# Altium schematic sheet Limit_Switches.SchDoc: RP2040 CNC
size B; Author: AM; CompanyName: Expatria Technologies; DrawnBy: A.Marles; Engineer: AM; Organization: Expatria Technolgoies; DocumentNumber: 7; SheetNumber: 7; SheetTotal: 14
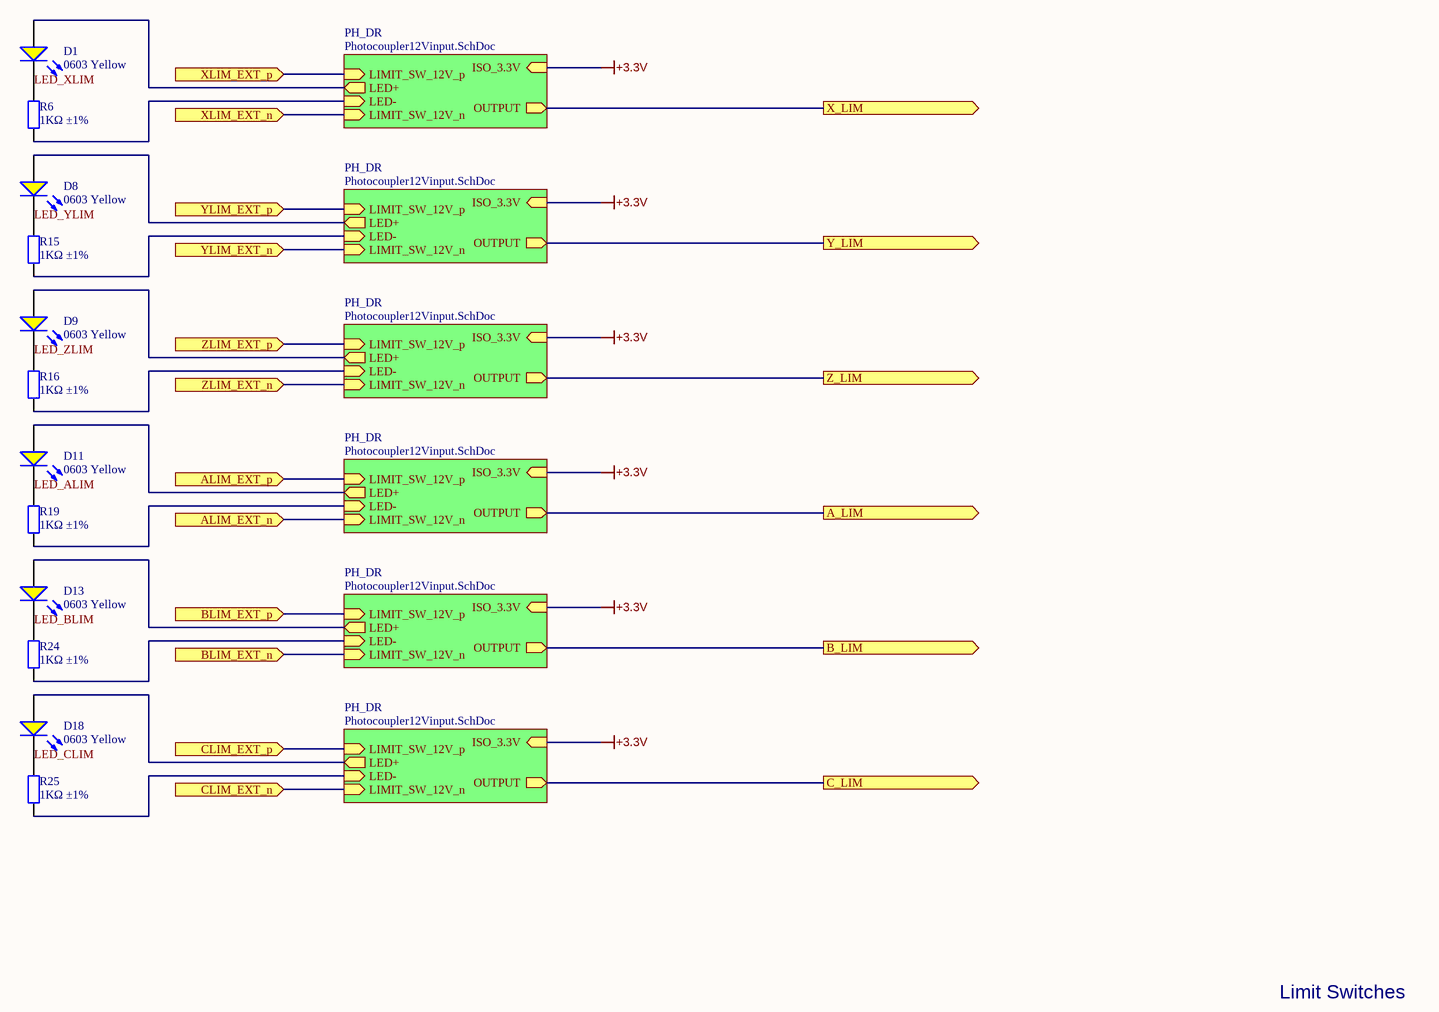
[diagram p0: Limit_Switches.SchDoc]

## Parts
D1  0603 Yellow  [0603_LED_S1]
D8  0603 Yellow  [0603_LED_S1]
D9  0603 Yellow  [0603_LED_S1]
D11  0603 Yellow  [0603_LED_S1]
D13  0603 Yellow  [0603_LED_S1]
D18  0603 Yellow  [0603_LED_S1]
R6  1KΩ ±1%  [0603_R]
R15  1KΩ ±1%  [0603_R]
R16  1KΩ ±1%  [0603_R]
R19  1KΩ ±1%  [0603_R]
R24  1KΩ ±1%  [0603_R]
R25  1KΩ ±1%  [0603_R]

## Sub-sheets
PH_DR = Photocoupler12Vinput.SchDoc: OUTPUT (out), LED+ (out), LED- (in), ISO_3.3V (in), LIMIT_SW_12V_n (in), LIMIT_SW_12V_p (in)
PH_DR = Photocoupler12Vinput.SchDoc: OUTPUT (out), LED+ (out), LED- (in), ISO_3.3V (in), LIMIT_SW_12V_n (in), LIMIT_SW_12V_p (in)
PH_DR = Photocoupler12Vinput.SchDoc: OUTPUT (out), LED+ (out), LED- (in), ISO_3.3V (in), LIMIT_SW_12V_n (in), LIMIT_SW_12V_p (in)
PH_DR = Photocoupler12Vinput.SchDoc: OUTPUT (out), LED+ (out), LED- (in), ISO_3.3V (in), LIMIT_SW_12V_n (in), LIMIT_SW_12V_p (in)
PH_DR = Photocoupler12Vinput.SchDoc: OUTPUT (out), LED+ (out), LED- (in), ISO_3.3V (in), LIMIT_SW_12V_n (in), LIMIT_SW_12V_p (in)
PH_DR = Photocoupler12Vinput.SchDoc: OUTPUT (out), LED+ (out), LED- (in), ISO_3.3V (in), LIMIT_SW_12V_n (in), LIMIT_SW_12V_p (in)

## Ports
A_LIM (out), ALIM_EXT_n (in), ALIM_EXT_p (in), B_LIM (out), BLIM_EXT_n (in), BLIM_EXT_p (in), C_LIM (out), CLIM_EXT_n (in), CLIM_EXT_p (in), X_LIM (out), XLIM_EXT_n (in), XLIM_EXT_p (in), Y_LIM (out), YLIM_EXT_n (in), YLIM_EXT_p (in), Z_LIM (out), ZLIM_EXT_n (in), ZLIM_EXT_p (in)

## Nets
+3.3V: sheet PH_DR/ISO_3.3V, sheet PH_DR/ISO_3.3V, sheet PH_DR/ISO_3.3V, sheet PH_DR/ISO_3.3V, sheet PH_DR/ISO_3.3V, sheet PH_DR/ISO_3.3V
A_LIM: port A_LIM, sheet PH_DR/OUTPUT
ALIM_EXT_n: port ALIM_EXT_n, sheet PH_DR/LIMIT_SW_12V_n
ALIM_EXT_p: port ALIM_EXT_p, sheet PH_DR/LIMIT_SW_12V_p
B_LIM: port B_LIM, sheet PH_DR/OUTPUT
BLIM_EXT_n: port BLIM_EXT_n, sheet PH_DR/LIMIT_SW_12V_n
BLIM_EXT_p: port BLIM_EXT_p, sheet PH_DR/LIMIT_SW_12V_p
C_LIM: port C_LIM, sheet PH_DR/OUTPUT
CLIM_EXT_n: port CLIM_EXT_n, sheet PH_DR/LIMIT_SW_12V_n
CLIM_EXT_p: port CLIM_EXT_p, sheet PH_DR/LIMIT_SW_12V_p
LED_ALIM: D11.K R19.1
LED_BLIM: D13.K R24.1
LED_CLIM: D18.K R25.1
LED_XLIM: D1.K R6.1
LED_YLIM: D8.K R15.1
LED_ZLIM: D9.K R16.1
X_LIM: port X_LIM, sheet PH_DR/OUTPUT
XLIM_EXT_n: port XLIM_EXT_n, sheet PH_DR/LIMIT_SW_12V_n
XLIM_EXT_p: port XLIM_EXT_p, sheet PH_DR/LIMIT_SW_12V_p
Y_LIM: port Y_LIM, sheet PH_DR/OUTPUT
YLIM_EXT_n: port YLIM_EXT_n, sheet PH_DR/LIMIT_SW_12V_n
YLIM_EXT_p: port YLIM_EXT_p, sheet PH_DR/LIMIT_SW_12V_p
Z_LIM: port Z_LIM, sheet PH_DR/OUTPUT
ZLIM_EXT_n: port ZLIM_EXT_n, sheet PH_DR/LIMIT_SW_12V_n
ZLIM_EXT_p: port ZLIM_EXT_p, sheet PH_DR/LIMIT_SW_12V_p
NetD1_A: D1.A ; sheet PH_DR/LED+
NetD8_A: D8.A ; sheet PH_DR/LED+
NetD9_A: D9.A ; sheet PH_DR/LED+
NetD11_A: D11.A ; sheet PH_DR/LED+
NetD13_A: D13.A ; sheet PH_DR/LED+
NetD18_A: D18.A ; sheet PH_DR/LED+
NetR6_2: R6.2 ; sheet PH_DR/LED-
NetR15_2: R15.2 ; sheet PH_DR/LED-
NetR16_2: R16.2 ; sheet PH_DR/LED-
NetR19_2: R19.2 ; sheet PH_DR/LED-
NetR24_2: R24.2 ; sheet PH_DR/LED-
NetR25_2: R25.2 ; sheet PH_DR/LED-

## Notes on the sheet
- Limit Switches
- SHEET
- Expatria Technologies
- 1136 Glade Court
- Port Coquitlam, BC V3B 1R5
- PROJECT
- SIZE
- ENGR
- MODIFIED
- DOCUMENT
- REV
- Copyright Expatria Technologies 2022. This document describes Open Hardware and is licensed under the CERN-OHL-S v2. No warranty is implied or expressed.
- EMAIL: INFO@EXPATRIA.CA
- B
- /

## Library data of the parts
D1 D8 D9 D11 D13 D18 = 0603 LED Yellow: LED; ComponentLink1Description: 供应商链接; ComponentLink1URL: http://www.szlcsc.com/product/details_73147.html; Package: 0603; Supplier: LC; SuppliersPartNumber: C72038; Color: Yellow
R6 R15 R16 R19 R24 R25 = 0603 1K (1001) 1%: Chip resistor; Manufacturer: Uniroyal Elec; PartNumber: 0603WAF1001T5E; Power: 1/10W; ComponentLink1Description: Supplier link; ComponentLink1URL: http://www.szlcsc.com/product/details_21904.html; Package: 0603; Supplier: LC; SuppliersPartNumber: C21190; Resistance: 1KΩ; Tolerance: 1%